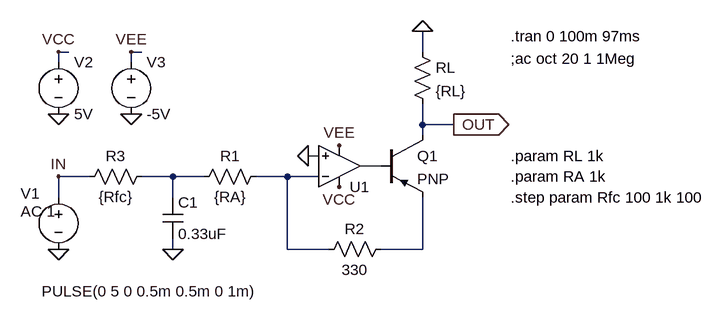
[diagram p0: schematic V-I Convert wLPF Amp.asc]
V-I Convert wLPF Amp.asc, the LTspice schematic file:
Version 4
SHEET 1 880 680
WIRE -176 -16 -192 -16
WIRE -64 -16 -80 -16
WIRE 368 -16 368 -48
WIRE -192 0 -192 -16
WIRE -80 0 -80 -16
WIRE 368 96 368 64
WIRE 416 96 368 96
WIRE 368 112 368 96
WIRE 208 144 192 144
WIRE 304 160 272 160
WIRE -144 176 -192 176
WIRE -16 176 -64 176
WIRE 32 176 -16 176
WIRE 160 176 112 176
WIRE 208 176 160 176
WIRE -192 208 -192 176
WIRE -16 208 -16 176
WIRE -16 288 -16 272
WIRE 160 288 160 176
WIRE 224 288 160 288
WIRE 368 288 368 208
WIRE 368 288 304 288
FLAG 192 144 0
FLAG 368 -48 0
FLAG 240 192 VCC
FLAG 240 128 VEE
FLAG -192 288 0
FLAG -192 80 0
FLAG -192 -16 VCC
FLAG -80 80 0
FLAG -80 -16 VEE
FLAG -192 176 IN
FLAG 416 96 OUT
IOPIN 416 96 Out
FLAG -16 288 0
SYMBOL Opamps\\UniversalOpamp2 240 160 M180
SYMATTR InstName U1
SYMBOL res 128 160 R90
WINDOW 0 0 56 VBottom 2
WINDOW 3 32 56 VTop 2
SYMATTR InstName R1
SYMATTR Value {RA}
SYMBOL res 320 272 R90
WINDOW 0 0 56 VBottom 2
WINDOW 3 32 56 VTop 2
SYMATTR InstName R2
SYMATTR Value 330
SYMBOL pnp 304 112 R0
SYMATTR InstName Q1
SYMBOL res 352 -32 R0
SYMATTR InstName RL
SYMATTR Value {RL}
SYMBOL voltage -192 192 R0
WINDOW 3 -26 161 Left 2
WINDOW 123 -58 38 Left 2
WINDOW 39 0 0 Left 2
WINDOW 0 -58 10 Left 2
SYMATTR Value PULSE(0 5 0 0.5m 0.5m 0 1m)
SYMATTR Value2 AC 1
SYMATTR InstName V1
SYMBOL voltage -192 -16 R0
SYMATTR InstName V2
SYMATTR Value 5V
SYMBOL voltage -80 -16 R0
WINDOW 123 0 0 Left 2
WINDOW 39 0 0 Left 2
SYMATTR InstName V3
SYMATTR Value -5V
SYMBOL cap -32 208 R0
SYMATTR InstName C1
SYMATTR Value 0.33uF
SYMBOL res -48 160 R90
WINDOW 0 0 56 VBottom 2
WINDOW 3 32 56 VTop 2
SYMATTR InstName R3
SYMATTR Value {Rfc}
TEXT 504 -40 Left 2 !.tran 0 100m 97ms
TEXT 504 144 Left 2 !.param RL 1k
TEXT 504 -6 Left 2 !;ac oct 20 1 1Meg
TEXT 504 208 Left 2 !.step param Rfc 100 1k 100
TEXT 504 176 Left 2 !.param RA 1k

The netlist it stands for:
* V-I Convert wLPF Amp.asc
XU1 0 N003 VCC VEE N001 level.2 Avol=1Meg GBW=10Meg Slew=10Meg ilimit=25m rail=0 Vos=0 phimargin=45 en=0 enk=0 in=0 ink=0 Rin=500Meg  ; pins IN+ IN- V+ V- OUT
R1 N003 N002 {RA}
R2 N004 N003 330
Q1 OUT N001 N004 0 PNP
RL 0 OUT {RL}
V1 IN 0 PULSE(0 5 0 0.5m 0.5m 0 1m) AC 1
V2 VCC 0 5V
V3 VEE 0 -5V
C1 N002 0 0.33uF
R3 N002 IN {Rfc}
.model NPN NPN
.model PNP PNP
.lib standard.bjt
.tran 0 100m 97ms
.param RL 1k
;ac oct 20 1 1Meg
.step param Rfc 100 1k 100
.param RA 1k
.lib UniversalOpamps2.sub
.backanno
.end